# Altium schematic sheet ControlTriacs.SchDoc
size A4
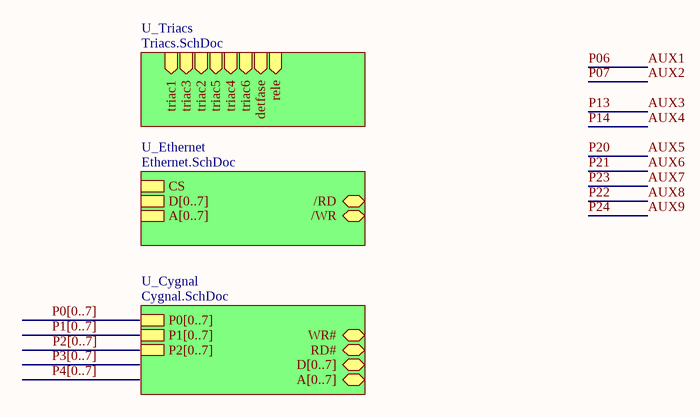
[diagram p0: ControlTriacs.SchDoc]

## Sub-sheets
U_Cygnal = Cygnal.SchDoc: P0[0..7], P1[0..7], P2[0..7], WR#, RD#, D[0..7], A[0..7]
U_Ethernet = Ethernet.SchDoc: CS, D[0..7], A[0..7], /RD, /WR
U_Triacs = Triacs.SchDoc: triac1 (in), triac3 (in), triac2 (in), triac5 (in), triac4 (in), triac6 (in), detfase (in), rele (in)

## Buses and harness runs
bus P0[0..7]
bus P1[0..7]
bus P2[0..7]
bus P3[0..7]
bus P4[0..7]